# EAGLE design Adafruit 2.4in TFT Breakout (EAGLE 6.4)
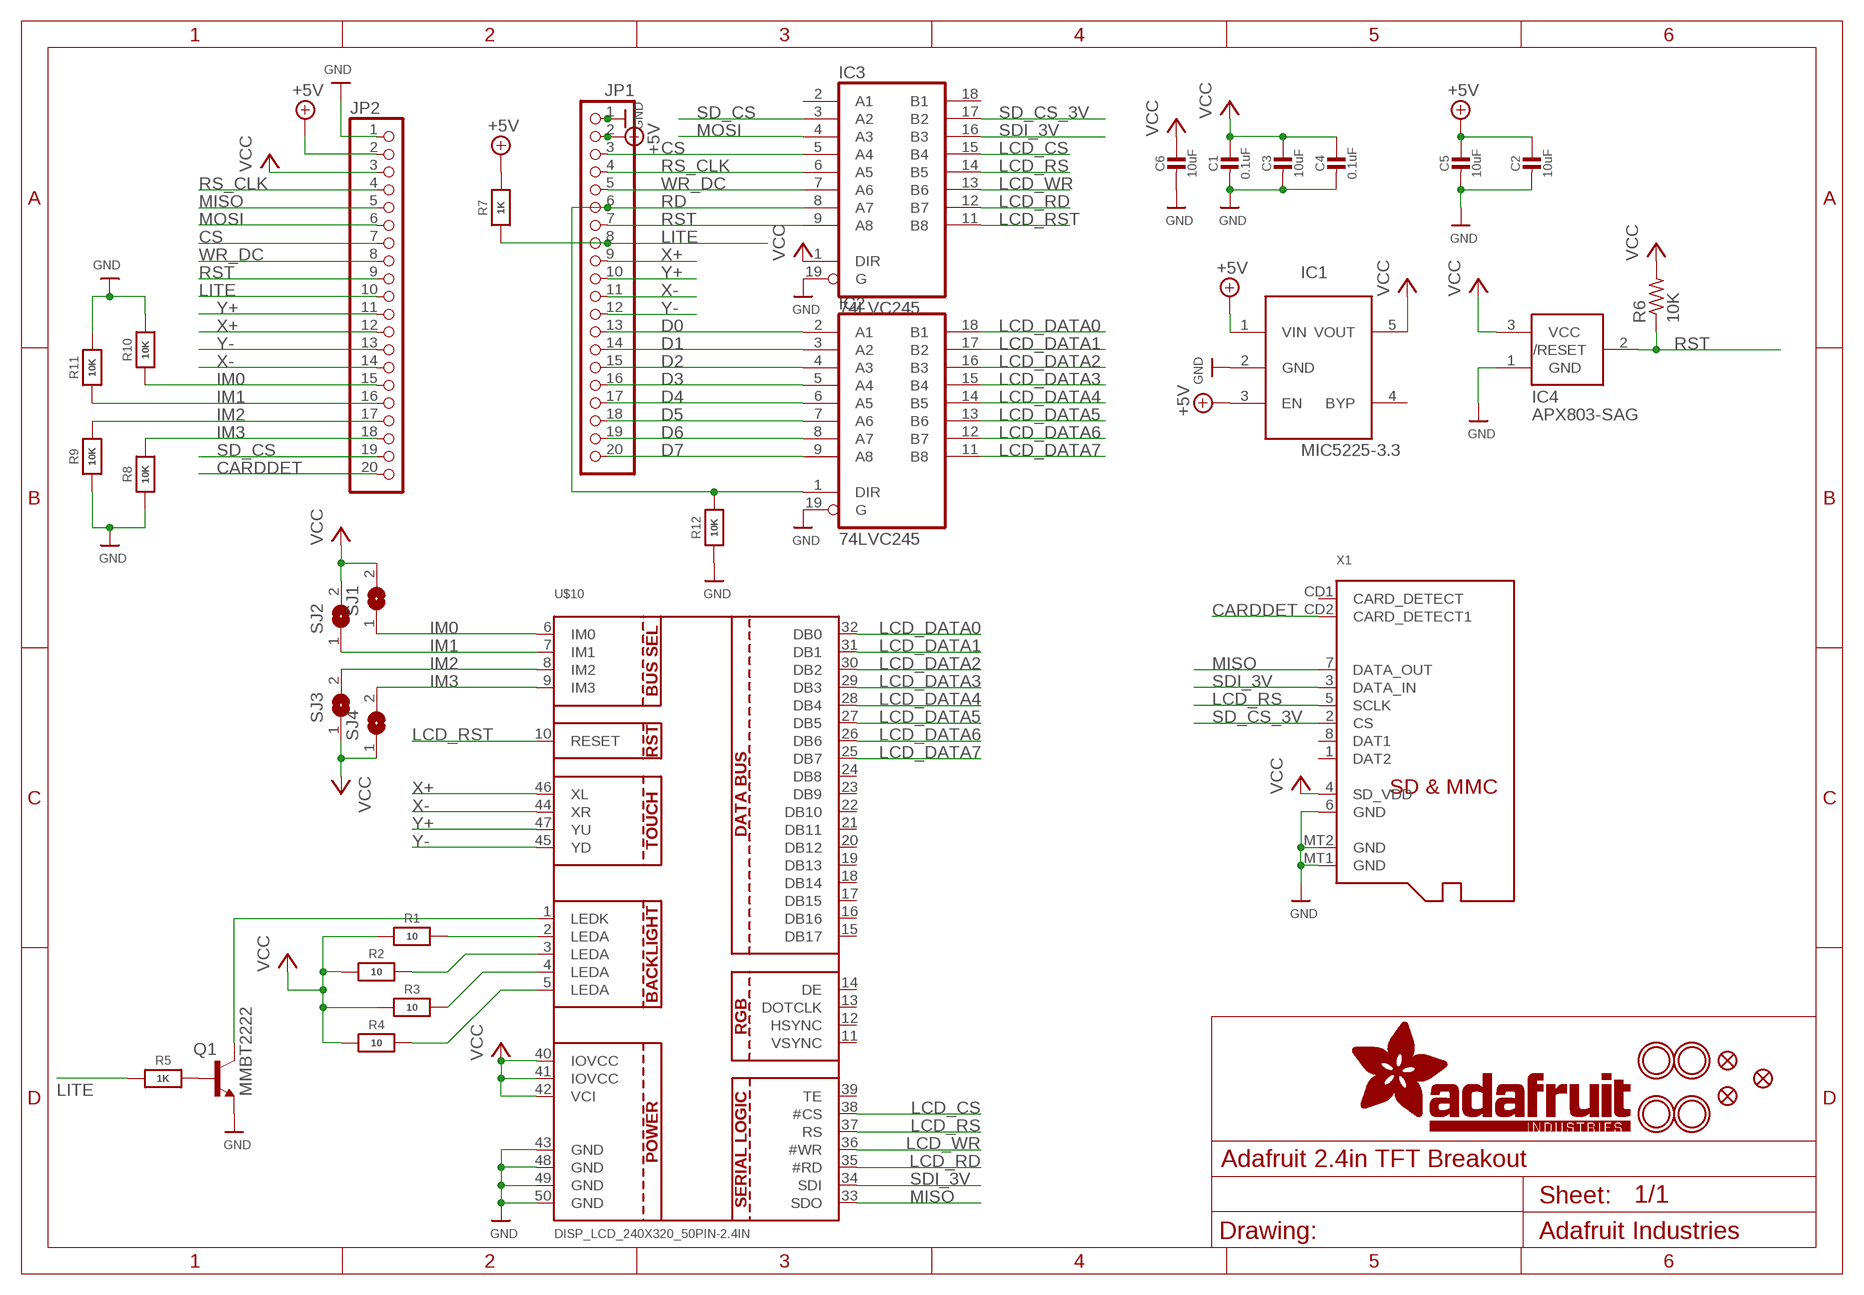
[diagram p0: schematic, sheet 1]

## Parts
C1  0.1uF  CAP_CERAMIC0805-NOOUTLINE  [0805-NO]
C2  10uF  CAP_CERAMIC0805-NOOUTLINE  [0805-NO]
C3  10uF  CAP_CERAMIC0805-NOOUTLINE  [0805-NO]
C4  0.1uF  CAP_CERAMIC0805-NOOUTLINE  [0805-NO]
C5  10uF  CAP_CERAMIC0805-NOOUTLINE  [0805-NO]
C6  10uF  CAP_CERAMIC0805-NOOUTLINE  [0805-NO]
IC1  MIC5225-3.3  LP298XS  [SOT23-5L]
IC2  74LVC245  74ACT245DW  [SO20W]
IC3  74LVC245  74ACT245DW  [SO20W]
IC4  APX803-SAG  AXP083-SAG  [SOT23]
JP1  HEADER-1X20ROUND  [1X20_ROUND]
JP2  HEADER-1X20ROUND  [1X20_ROUND]
Q1  MMBT2222  MMBT2222ALT1-NPN-SOT23-BEC  [SOT23-BEC]
R1  10  RESISTOR0805_NOOUTLINE  [0805-NO]
R2  10  RESISTOR0805_NOOUTLINE  [0805-NO]
R3  10  RESISTOR0805_NOOUTLINE  [0805-NO]
R4  10  RESISTOR0805_NOOUTLINE  [0805-NO]
R5  1K  RESISTOR0805_NOOUTLINE  [0805-NO]
R6  10K  R-US_R0805  [R0805]
R7  1K  RESISTOR0805_NOOUTLINE  [0805-NO]
R8  10K  RESISTOR0805_NOOUTLINE  [0805-NO]
R9  10K  RESISTOR0805_NOOUTLINE  [0805-NO]
R10  10K  RESISTOR0805_NOOUTLINE  [0805-NO]
R11  10K  RESISTOR0805_NOOUTLINE  [0805-NO]
R12  10K  RESISTOR0805_NOOUTLINE  [0805-NO]
SJ1  SOLDERJUMPER  [SOLDERJUMPER_ARROW_NOPASTE]
SJ2  SOLDERJUMPER  [SOLDERJUMPER_ARROW_NOPASTE]
SJ3  SOLDERJUMPER  [SOLDERJUMPER_ARROW_NOPASTE]
SJ4  SOLDERJUMPER  [SOLDERJUMPER_ARROW_NOPASTE]
U$7  MOUNTINGHOLE2.5  [MOUNTINGHOLE_2.5_PLATED]
U$9  FIDUCIAL""  [FIDUCIAL_1MM]
U$10  DISP_LCD_240X320_50PIN-2.4IN  [TFT_2.4IN_240X320_50PIN]
U$11  FIDUCIAL""  [FIDUCIAL_1MM]
U$15  MOUNTINGHOLE2.5  [MOUNTINGHOLE_2.5_PLATED]
U$16  MOUNTINGHOLE2.5  [MOUNTINGHOLE_2.5_PLATED]
U$17  MOUNTINGHOLE2.5  [MOUNTINGHOLE_2.5_PLATED]
U$23  FIDUCIAL""  [FIDUCIAL_1MM]
X1  MICROSD  [MICROSD]

## Nets
+3V: C1.1 C3.1 C4.1 C6.1 IC1.5(VOUT) IC3.1(DIR) IC4.3(VCC) JP2.3 R1.1 R2.1 R3.1 R4.1 R6.2 SJ1.2 SJ2.2 SJ3.1 SJ4.1 U$10.40(IOVCC) U$10.41(IOVCC) U$10.42(VCI) X1.4(SD_VDD) ; supply symbol labelled VCC
CARDDET: JP2.20 X1.CD2(CARD_DETECT1)
CS: IC3.5(A4) JP1.3 JP2.7
D0: IC2.2(A1) JP1.13
D1: IC2.3(A2) JP1.14
D2: IC2.4(A3) JP1.15
D3: IC2.5(A4) JP1.16
D4: IC2.6(A5) JP1.17
D5: IC2.7(A6) JP1.18
D6: IC2.8(A7) JP1.19
D7: IC2.9(A8) JP1.20
GND: C1.2 C2.2 C3.2 C4.2 C5.2 C6.2 IC1.2(GND) IC2.19(G) IC3.19(G) IC4.1(GND) JP1.1 JP2.1 Q1.E R8.1 R9.1 R10.2 R11.2 R12.1 U$10.43(GND) U$10.48(GND) U$10.49(GND) U$10.50(GND) X1.6(GND) X1.MT1(GND) X1.MT2(GND)
IM0: JP2.15 R10.1 SJ1.1 U$10.6(IM0)
IM1: JP2.16 R11.1 SJ2.1 U$10.7(IM1)
IM2: JP2.17 R9.2 SJ3.2 U$10.8(IM2)
IM3: JP2.18 R8.2 SJ4.2 U$10.9(IM3)
LCD_CS: IC3.15(B4) U$10.38(#CS)
LCD_DATA0: IC2.18(B1) U$10.32(DB0)
LCD_DATA1: IC2.17(B2) U$10.31(DB1)
LCD_DATA2: IC2.16(B3) U$10.30(DB2)
LCD_DATA3: IC2.15(B4) U$10.29(DB3)
LCD_DATA4: IC2.14(B5) U$10.28(DB4)
LCD_DATA5: IC2.13(B6) U$10.27(DB5)
LCD_DATA6: IC2.12(B7) U$10.26(DB6)
LCD_DATA7: IC2.11(B8) U$10.25(DB7)
LCD_RD: IC3.12(B7) U$10.35(#RD)
LCD_RS: IC3.14(B5) U$10.37(RS) X1.5(SCLK)
LCD_RST: IC3.11(B8) U$10.10(RESET)
LCD_WR: IC3.13(B6) U$10.36(#WR)
LITE: JP1.8 JP2.10 R5.1 R7.1
MISO: JP2.5 U$10.33(SDO) X1.7(DATA_OUT)
MOSI: IC3.4(A3) JP2.6
N$1: R4.2 U$10.5(LEDA)
N$2: R1.2 U$10.2(LEDA)
N$3: R2.2 U$10.3(LEDA)
N$4: R3.2 U$10.4(LEDA)
N$5: Q1.C U$10.1(LEDK)
N$16: Q1.B R5.2
RD: IC2.1(DIR) IC3.8(A7) JP1.6 R12.2
RS_CLK: IC3.6(A5) JP1.4 JP2.4
RST: IC3.9(A8) IC4.2(/RESET) JP1.7 JP2.9 R6.1
SD_CS: IC3.3(A2) JP2.19
SD_CS_3V: IC3.17(B2) X1.2(CS)
SDI_3V: IC3.16(B3) U$10.34(SDI) X1.3(DATA_IN)
VIN: C2.1 C5.1 IC1.1(VIN) IC1.3(EN) JP1.2 JP2.2 R7.2 ; supply symbol labelled +5V
WR_DC: IC3.7(A6) JP1.5 JP2.8
X+: JP1.9 JP2.12 U$10.46(XL)
X-: JP1.11 JP2.14 U$10.44(XR)
Y+: JP1.10 JP2.11 U$10.47(YU)
Y-: JP1.12 JP2.13 U$10.45(YD)
Unconnected: IC1.4(BYP) IC3.2(A1) IC3.18(B1) U$10.11(VSYNC) U$10.12(HSYNC) U$10.13(DOTCLK) U$10.14(DE) U$10.15(DB17) U$10.16(DB16) U$10.17(DB15) U$10.18(DB14) U$10.19(DB13) U$10.20(DB12) U$10.21(DB11) U$10.22(DB10) U$10.23(DB9) U$10.24(DB8) U$10.39(TE) X1.1(DAT2) X1.8(DAT1) X1.CD1(CARD_DETECT)

## Power pins joined to a net without a drawn wire
+3V: IC2.20(VCC) IC3.20(VCC)
GND: IC2.10(GND) IC3.10(GND)

## Library data of the parts
C1-C6 = microbuilder:CAP_CERAMIC: Ceramic Capacitors For new designs, use the packages preceded by an '_' character since they are more reliable: The following footprints should be used on most boards: _0402 - Standard footprint for regular board layouts _0603 - Standard footprint for regular board layouts _0805 - Standard footprint for regular board layouts _1206 - Standard footprint for regular board layouts For extremely tight-pitch boards where space is at a premium, the following 'micro-pitch' footprints can be used (smaller pads, no silkscreen outline, etc.): _0402MP - Micro-pitch footprint for very dense/compact boards _0603MP - Micro-pitch footprint for very dense/compact boards _0805MP - Micro-pitch footprint for very dense/compact boards _1206MP - Micro-pitch footprint for very dense/compact boards
IC1 = adafruit:LP298X
IC2 IC3 = 74xx-eu:74*245: Octal BUS TRANSCEIVER, 3-state
IC4 = adafruit:AXP083
JP1 JP2 = microbuilder:HEADER-1X20
Q1 = transistor-neu-to92:*-NPN-: NPN Transistror
R1-R5 R7-R12 = microbuilder:RESISTOR: Resistors For new designs, use the packages preceded by an '_' character since they are more reliable: The following footprints should be used on most boards: _0402 - Standard footprint for regular board layouts _0603 - Standard footprint for regular board layouts _0805 - Standard footprint for regular board layouts _1206 - Standard footprint for regular board layouts For extremely tight-pitch boards where space is at a premium, the following 'micro-pitch' footprints can be used (smaller pads, no silkscreen outline, etc.): _0402MP - Micro-pitch footprint for very dense/compact boards _0603MP - Micro-pitch footprint for very dense/compact boards _0805MP - Micro-pitch footprint for very dense/compact boards _1206MP - Micro-pitch footprint for very dense/compact boards
R6 = rcl:R-US_: RESISTOR, American symbol
SJ1-SJ4 = microbuilder:SOLDERJUMPER: SMD Solder JUMPER Solder the two pads together to create a connection, or remove the solder to break it. REFLOW - Use this footprint for solder paste and reflow ovens. WAVE - Use this footprint for hand-soldering (larger pads). CLOSED - Has a trace between the two pads to ensure it is closed by default. The trace needs to be cut to disable the jumper, and can be closed again by creating a solder bridge between the two pads.; BOM: EXCLUDE
U$7 U$15-U$17 = microbuilder:MOUNTINGHOLE: Mounting Hole For #2 screws (0.086"/2.18mm width, 0.094"/2.4mm hole) use 2.5mm; BOM: EXCLUDE
U$9 U$11 U$23 = microbuilder:FIDUCIAL: Fiducial Alignment Points Various fiducial points for machine vision alignment.; BOM: EXCLUDE
U$10 = microbuilder:DISP_LCD_240X320_50PIN
X1 = microbuilder:MICROSD: MicroSD/Transflash Card Holder with SPI pinout 3M: 2908-05WB-MG 4UConnector: 19656 Footprint courtesy: Adafruit Industries

## Board
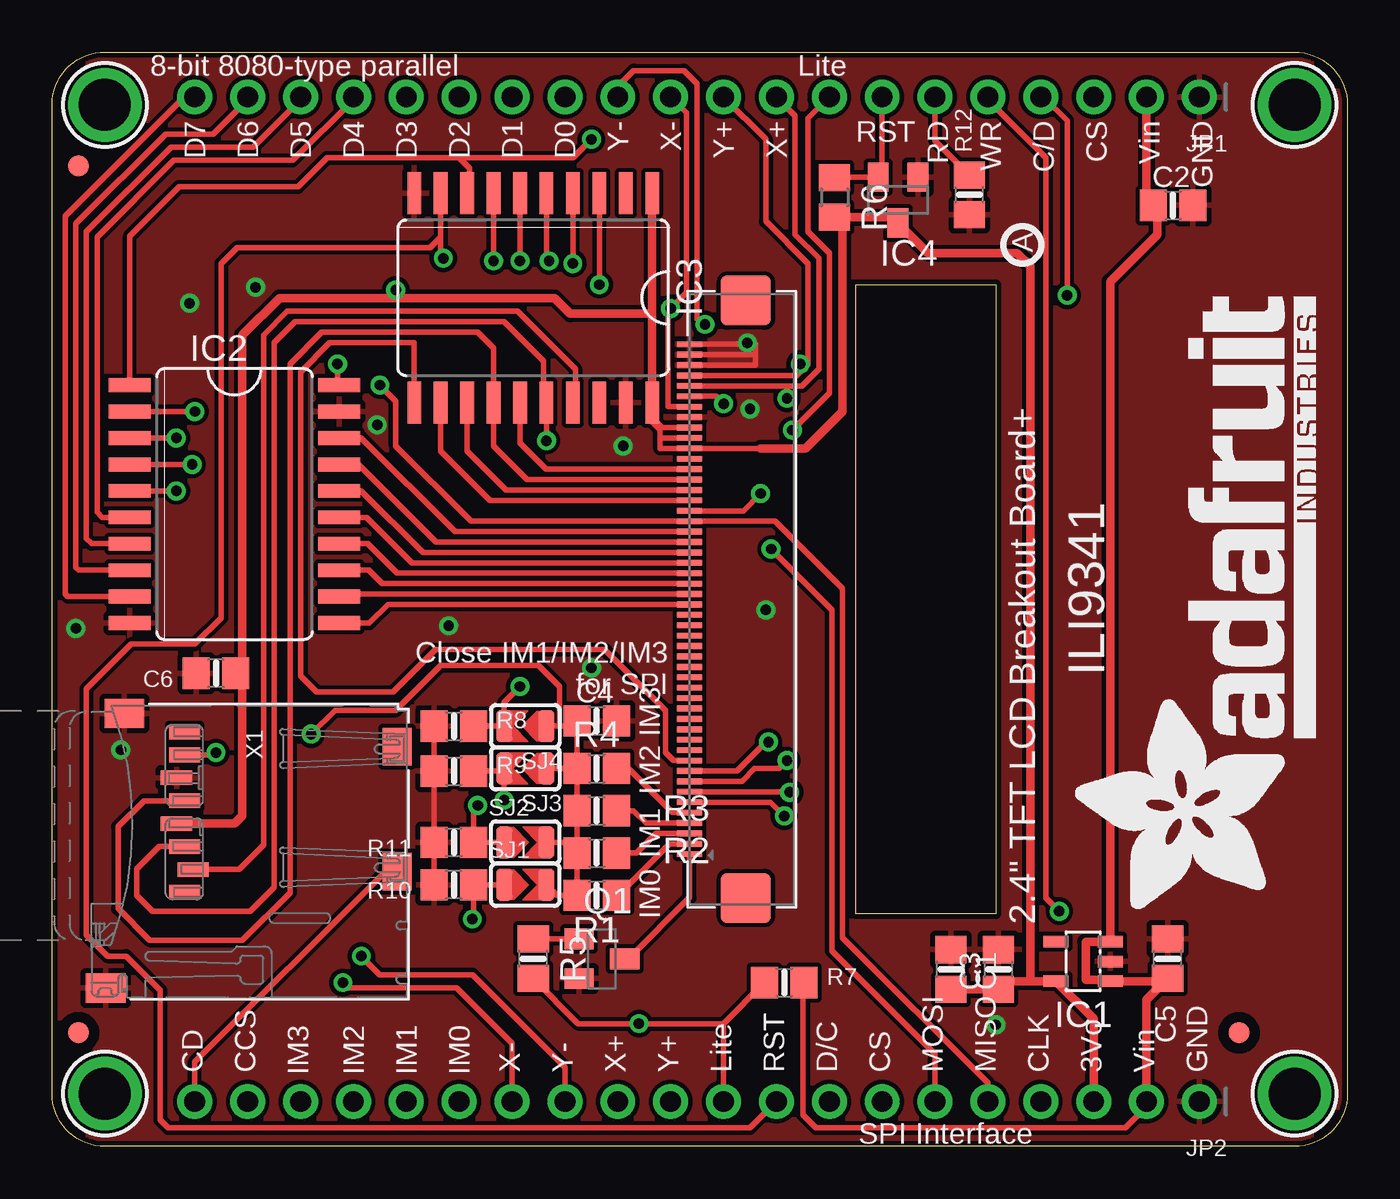
[diagram p1: board, top side]
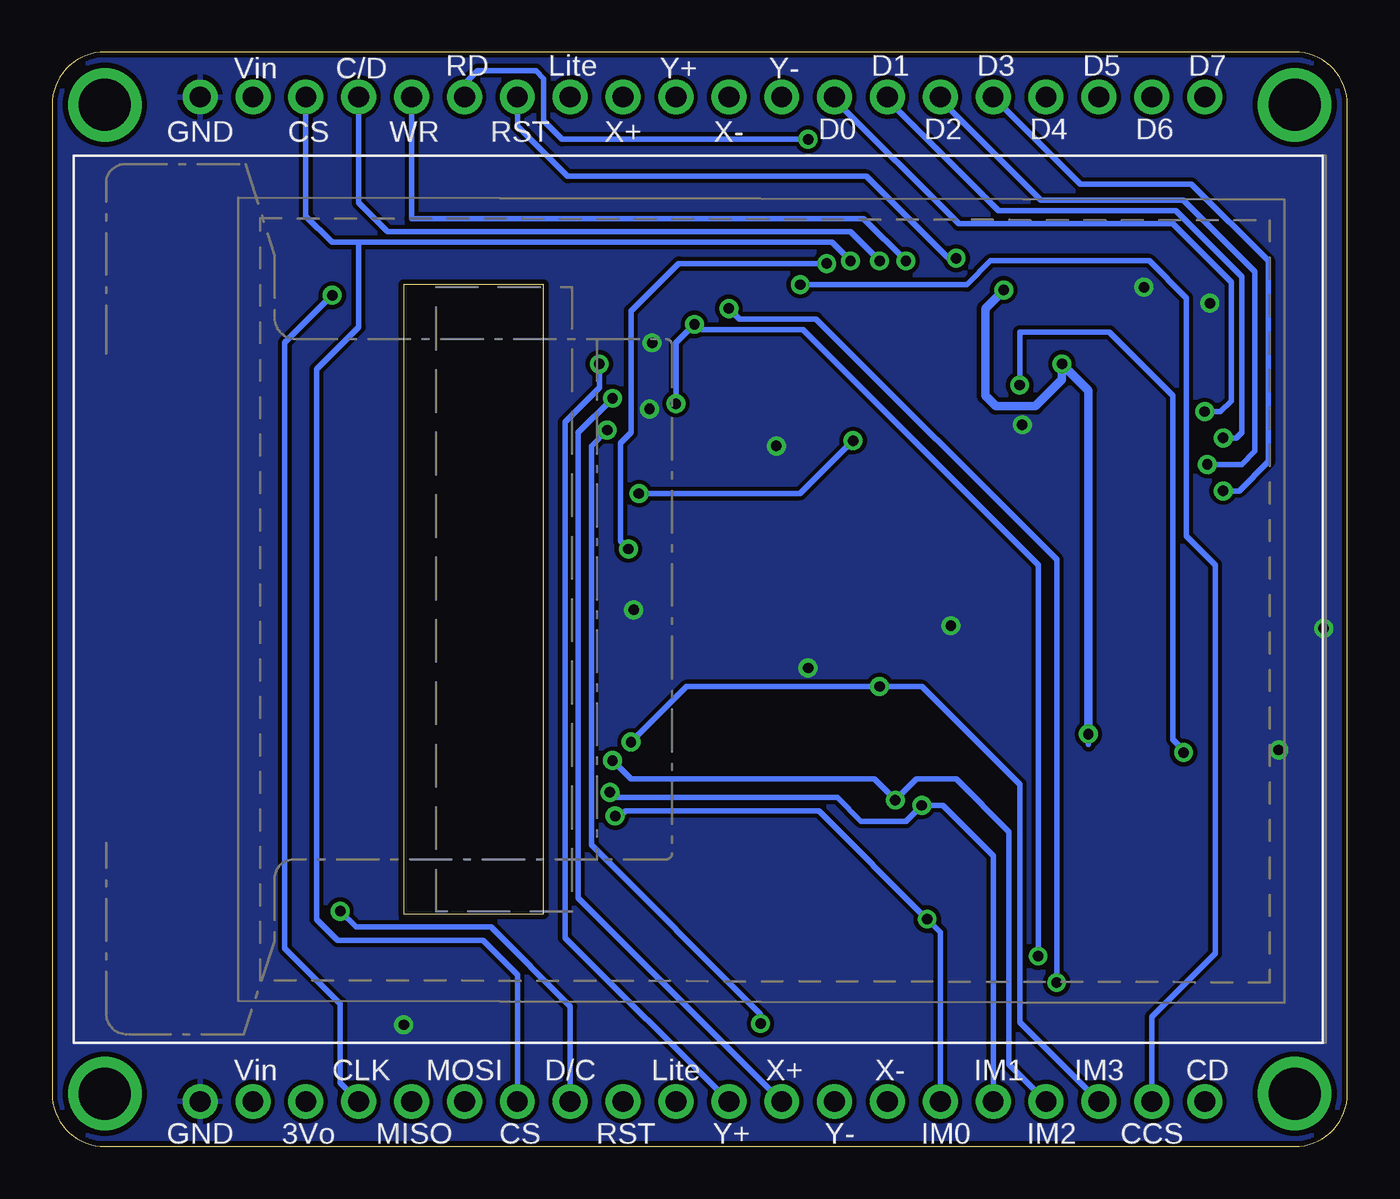
[diagram p2: board, bottom side, seen from below]

Size 62.23 x 52.58 mm. Coordinates in mm from the lower left corner, seen from the top.
Outline: 0,2.54 0,50.04 arc-90 2.54,52.58 59.69,52.58 arc-90 62.23,50.04 62.23,2.54 arc-90 59.69,0 2.54,0 arc-90 0,2.54
Outline: 38.61,11.18 38.61,41.4 45.34,41.4 45.34,11.18 38.61,11.18
Copper layers (1*16): Top 0.035mm / dielectric 1.5mm / Bottom 0.035mm
Design rules "adafruit *": minimum track width 8mil, minimum drill 15.5mil, track to track 8mil, track to pad 8mil, pad to pad 8mil, via to via 8mil, smd to smd 8mil, copper to edge 10mil, drill to drill 8mil, minimum pad ring 10mil, minimum via ring 8mil, stop-mask expansion 2mil, vias tented up to drill 20mil, thermal gap 10mil

### Footprints (pad centres in the part's own frame; a part is rotated, then mirrored left to right if it is on the bottom)
0805-NO = smd 1.3 x 1.5: 1 -0.95,0; 2 0.95,0
SOT23-5L = smd 0.55 x 1.2: 1 -0.95,-1.3; 2 0,-1.3; 3 0.95,-1.3; 4 0.95,1.3; 5 -0.95,1.3
SO20W = smd 0.66 x 2.032: 1 -5.715,-5.029; 2 -4.445,-5.029; 3 -3.175,-5.029; 4 -1.905,-5.029; 5 -0.635,-5.029; 6 0.635,-5.029; 7 1.905,-5.029; 8 3.175,-5.029; 9 4.445,-5.029; 10 5.715,-5.029; 11 5.715,5.029; 12 4.445,5.029; 13 3.175,5.029; 14 1.905,5.029; 15 0.635,5.029; 16 -0.635,5.029; 17 -1.905,5.029; 18 -3.175,5.029; 19 -4.445,5.029; 20 -5.715,5.029
SOT23 = smd 1 x 1.4: 1 -0.95,-1.1; 2 0.95,-1.1; 3 0,1.1
1X20_ROUND = drill 1 pad 1.676: 1 -24.13,0; 2 -21.59,0; 3 -19.05,0; 4 -16.51,0; 5 -13.97,0; 6 -11.43,0; 7 -8.89,0; 8 -6.35,0; 9 -3.81,0; 10 -1.27,0; 11 1.27,0; 12 3.81,0; 13 6.35,0; 14 8.89,0; 15 11.43,0; 16 13.97,0; 17 16.51,0; 18 19.05,0; 19 21.59,0; 20 24.13,0
SOT23-BEC = smd 1 x 1.4: B -0.95,-1.1; C 0,1.1; E 0.95,-1.1
R0805 = smd 1.3 x 1.5: 1 -0.95,0; 2 0.95,0
SOLDERJUMPER_ARROW_NOPASTE = smd 0.762 x 1.524: 1 -1.016,0; 2 1.016,0
MOUNTINGHOLE_2.5_PLATED = drill 2.5 pad 3.2: P$1 0,0
FIDUCIAL_1MM = smd 1 x 1: 1 0,0
TFT_2.4IN_240X320_50PIN = smd 0.275 x 1.2 bottom: 1 12.25,28.551; 2 11.75,28.551; 3 11.25,28.551; 4 10.75,28.551; 5 10.25,28.551; 6 9.75,28.551; 7 9.25,28.551; 8 8.75,28.551; 9 8.25,28.551; 10 7.75,28.551; 11 7.25,28.551; 12 6.75,28.551; 13 6.25,28.551; 14 5.75,28.551; 15 5.25,28.551; 16 4.75,28.551; 17 4.25,28.551; 18 3.75,28.551; 19 3.25,28.551; 20 2.75,28.551; 21 2.25,28.551; 22 1.75,28.551; 23 1.25,28.551; 24 0.75,28.551; 25 0.25,28.551; 26 -0.25,28.551; 27 -0.75,28.551; 28 -1.25,28.551; 29 -1.75,28.551; 30 -2.25,28.551; 31 -2.75,28.551; 32 -3.25,28.551; 33 -3.75,28.551; 34 -4.25,28.551; 35 -4.75,28.551; 36 -5.25,28.551; 37 -5.75,28.551; 38 -6.25,28.551; 39 -6.75,28.551; 40 -7.25,28.551; 41 -7.75,28.551; 42 -8.25,28.551; 43 -8.75,28.551; 44 -9.25,28.551; 45 -9.75,28.551; 46 -10.25,28.551; 47 -10.75,28.551; 48 -11.25,28.551; 49 -11.75,28.551; 50 -12.25,28.551 | smd 2.4 x 2.4 bottom: PAD1 14.35,25.851; PAD2 -14.35,25.851
MICROSD = smd 0.7 x 1.5: 1 9,-10.64; 2 7.9,-10.24; 3 6.8,-10.64; 4 5.7,-11.04; 5 4.6,-10.64; 6 3.5,-11.04; 7 2.4,-10.64; 8 1.3,-10.64 | smd 1.8 x 1.4: CD1 2,-0.44; CD2 8,-0.44 | smd 1.4 x 1.9: MT1 0.4,-13.54; MT2 13.6,-14.44

### Placement (x,y rotation side)
C1  43.18,8.51 90 top
C2  53.85,45.21 0 top
C3  45.47,8.51 90 top
C4  26.16,20.45 0 top
C5  53.59,9.02 90 top
C6  7.87,22.73 180 top
IC1  49.53,8.89 90 top
IC2  8.76,30.86 270 top
IC3  23.11,40.77 180 top
IC4  40.64,45.47 180 top
JP1  30.99,50.42 180 top
JP2  30.99,2.16 180 top
Q1  26.42,9.02 270 top
R1  26.16,12.06 0 top
R2  26.16,14.1 0 top
R3  26.16,16.13 0 top
R4  26.16,18.16 0 top
R5  23.11,9.02 90 top
R6  37.59,45.59 270 top
R7  35.18,7.87 0 top
R8  19.3,20.19 0 top
R9  19.3,18.03 0 top
R10  19.3,12.57 180 top
R11  19.3,14.61 180 top
R12  44.07,45.72 90 top
SJ1  22.73,12.57 0 top
SJ2  22.73,14.61 0 top
SJ3  22.73,18.16 180 top
SJ4  22.73,20.19 180 top
U$7  2.54,2.54 0 top
U$9  57.02,5.46 0 top
U$10  59.18,26.29 270 bottom
U$11  1.27,47.12 0 top
U$15  59.69,2.54 0 top
U$16  2.54,50.04 0 top
U$17  59.69,50.04 0 top
U$19  [ADAFRUIT_TEXT_30MM]  60.71,11.18 90 top
U$23  1.27,5.46 0 top
U$26  [PCBFEAT-REV-040]  46.61,43.31 90 top
X1  17.02,21.21 270 top

### Tracks (layer width: path | path; a pad name or v marks a point on that pad's centre or on a via)
+3V  (via drill 0.5)
  Top 0.254: U$10.42 29.21,34.54 29.21,34.04 | 28.83,34.92 IC3.20 | 34.04,33.54 U$10.40 29.21,33.54 29.21,34.04 | 40.36,44.64 IC4.3 | R2.1 R3.1 R4.1 | R2.1 R1.1 24.26,12.06 SJ1.2 | R4.1 C4.1 24.96,20.19 24.38,20.19 | SJ4.1 24.38,20.19 | SJ3.1 R4.1 | SJ2.2 24.7,14.61 R2.1 | IC2.20 13.72,36.65 v13.72,37.59 | v12.45,19.81 13.59,20.95 16.51,20.95 18.67,23.11 23.37,23.11 24.38,22.1 24.38,20.19 | v16.51,41.15 16.51,40.77 | C6.1 9.02,22.73 9.14,22.86 | U$10.41 29.21,34.04 | 37.97,44.52 37.85,44.64 R6.2
  Top 0.406: IC3.1 28.83,40.01 | 28.83,40.01 IC3.20 | 29.21,34.54 28.83,34.92 | R6.2 40.36,44.64 | JP2.3 50.04,6.13 IC1.5 46.99,7.94 | C1.1 C3.1 45.85,7.94 46.99,7.94 | X1.4 8.76,15.51 9.14,15.89 9.14,22.86 9.14,38.99 10.92,40.77 16.51,40.77 24.13,40.77 24.89,40.01 28.83,40.01 | 37.97,44.52 37.97,35.32 36.2,33.54 34.04,33.54 | IC4.3 42.08,42.93 46.35,42.93 46.99,42.29 46.99,7.94
  Bottom 0.254: 12.45,19.3 v12.45,19.81
  Bottom 0.406: v12.45,19.81 12.45,36.32 v13.72,37.59 13.72,36.83 14.99,35.56 16.89,35.56 17.4,36.07 17.4,40.26 v16.51,41.15
CARDDET
  Top 0.254: JP2.20 6.86,4.06 15.88,13.08 16.45,13.08 X1.CD2
CS  (via drill 0.5)
  Top 0.254: v23.88,42.55 23.75,42.67 IC3.5
  Bottom 0.254: JP1.3 50.04,44.7 48.77,43.43 47.5,43.43 | 47.5,43.43 24.77,43.43 v23.88,42.55 | JP2.7 39.88,8.26 41.53,9.91 48.51,9.91 49.53,10.92 49.53,37.34 47.5,39.37 47.5,43.43
D0  (via drill 0.5)
  Top 0.254: v6.86,35.31 IC2.2
  Bottom 0.254: v6.86,35.31 6.1,35.31 5.59,35.81 5.59,41.53 8.38,44.32 18.67,44.32 24.64,50.29 JP1.13
D1  (via drill 0.5)
  Top 0.254: v5.97,34.04 IC2.3
  Bottom 0.254: v5.97,34.04 5.33,34.04 5.08,34.29 5.08,41.78 8.26,44.96 16.76,44.96 22.1,50.29 JP1.14
D2  (via drill 0.5)
  Top 0.254: v6.73,32.77 IC2.4
  Bottom 0.254: v6.73,32.77 5.08,32.77 4.45,33.4 4.45,42.04 7.87,45.47 14.73,45.47 19.56,50.29 JP1.15
D3  (via drill 0.5)
  Top 0.254: v5.97,31.5 IC2.5
  Bottom 0.254: JP1.16 12.83,46.23 7.49,46.23 3.81,42.55 3.81,32.89 5.21,31.5 v5.97,31.5
D4
  Top 0.254: IC2.6 2.41,30.23 2.16,30.48 2.16,43.69 5.84,47.37 11.56,47.37 14.48,50.29 JP1.17
D5
  Top 0.254: IC2.7 1.91,28.96 1.65,29.21 1.65,43.94 5.71,48.01 9.65,48.01 11.94,50.29 JP1.18
D6
  Top 0.254: IC2.8 1.27,27.69 1.14,27.81 1.14,44.32 5.46,48.64 7.75,48.64 9.4,50.29 JP1.19
D7
  Top 0.254: IC2.9 0.76,26.42 0.64,26.54 0.64,44.7 6.35,50.42 JP1.20
GND  (via drill 0.5)
  Top 0.254: U$10.50 33.78,38.54 33.78,38.04 | 33.78,38.04 33.78,37.54 U$10.48 | U$10.49 33.78,38.04 | R8.1 R9.1 R11.2 R10.2
  other vias: 27.43,33.66 33.53,35.43 33.4,38.61 15.62,34.67 45.34,5.84 3.3,19.05 1.14,24.89 19.05,25.02 34.29,25.78 9.78,41.27 6.6,40.51 25.91,22.99
  pour Bottom: -0.51,53.34 -0.51,-0.64 62.61,-0.64 62.61,53.34
  pour Top: -0.51,53.47 -0.51,-0.51 62.61,-0.51 62.61,53.47
IM0  (via drill 0.5)
  Top 0.254: v35.18,15.88 34.52,16.54 U$10.6 | SJ1.1 R10.1 20.25,10.98 v20.19,10.92
  Bottom 0.254: v35.18,15.88 34.92,15.88 34.67,16.13 25.4,16.13 v20.19,10.92 19.56,10.29 JP2.15
IM1  (via drill 0.5)
  Top 0.254: U$10.7 35.41,17.04 v35.43,17.02 | SJ2.1 R11.1 20.25,16.19 v20.45,16.38 20.38,16.32
  Bottom 0.254: 35.31,16.89 v35.43,17.02 35.18,16.76 24.51,16.76 23.37,15.62 21.21,15.62 v20.45,16.38 19.43,16.38 17.02,13.97 JP2.16
IM2  (via drill 0.5)
  Top 0.254: v21.72,16.64 SJ3.2 21.59,18.03 R9.2 | v35.31,18.54 34.92,18.16 33.76,18.16 33.13,17.54 U$10.8
  Bottom 0.254: JP2.17 16.26,3.94 16.26,15.11 18.8,17.65 20.7,17.65 v21.72,16.64 22.73,17.65 34.42,17.65 v35.31,18.54
IM3  (via drill 0.5)
  Top 0.254: v22.48,22.1 21.72,21.34 SJ4.2 R8.2 | v34.42,19.43 34.29,19.43 32.89,18.03 U$10.9
  Bottom 0.254: v34.42,19.43 31.75,22.1 v22.48,22.1 20.45,22.1 15.75,17.4 15.75,5.97 JP2.18
LCD_CS
  Top 0.254: U$10.38 23.72,32.54 22.48,33.78 IC3.15
LCD_DATA0
  Top 0.254: U$10.32 19.36,29.54 14.86,34.04 IC2.18
LCD_DATA1
  Top 0.254: U$10.31 18.46,29.04 14.73,32.77 IC2.17
LCD_DATA2
  Top 0.254: U$10.30 17.82,28.54 14.86,31.5 IC2.16
LCD_DATA3
  Top 0.254: U$10.29 17.3,28.04 15.11,30.23 IC2.15
LCD_DATA4
  Top 0.254: U$10.28 16.57,27.54 15.15,28.96 IC2.14
LCD_DATA5
  Top 0.254: U$10.27 15.86,27.04 15.24,27.66 15.24,27.69 IC2.13
LCD_DATA6
  Top 0.254: U$10.26 13.91,26.54 IC2.12
LCD_DATA7
  Top 0.254: U$10.25 16.13,26.04 15.24,25.15 IC2.11
LCD_RD
  Top 0.254: U$10.35 21.03,31.04 18.67,33.4 IC3.12
LCD_RS
  Top 0.254: U$10.37 22.82,32.04 21.21,33.66 IC3.14 21.21,38.35 20.45,39.12 12.95,39.12 11.43,37.59 11.43,12.19 9.14,9.91 4.7,9.91 3.17,11.43 3.17,15.37 4.42,16.61 X1.5
LCD_RST
  Top 0.254: IC3.11 17.4,38.61 13.34,38.61 11.94,37.21 11.94,22.61 12.7,21.84 16.38,21.84 18.41,23.88 26.54,23.88 29.46,20.95 29.46,18.92 29.84,18.54 U$10.10
LCD_WR
  Top 0.254: U$10.36 21.8,31.54 19.94,33.4 IC3.13
LITE  (via drill 0.5)
  Top 0.254: R7.1 32.26,5.9 | 32.26,5.9 JP2.10 | R5.1 25.28,5.9 v28.19,5.9 32.26,5.9 | v35.56,34.42 37.34,36.2 37.34,42.93 36.32,43.94 36.32,49.4 JP1.8
  Bottom 0.254: v35.56,34.42 36.32,33.66 36.32,14.48 28.19,6.35 v28.19,5.9
MISO  (via drill 0.5)
  Top 0.254: v15.75,36.58 16.51,35.81 16.51,33.66 20.13,30.04 U$10.33 34.73,30.04 37.97,26.8 37.97,10.03 44.96,3.05 JP2.5 | v7.87,18.92 7.76,18.81 X1.7
  Bottom 0.254: v15.75,36.58 15.75,39.12 11.43,39.12 8.38,36.07 8.38,19.56 7.87,19.05 v7.87,18.92
MOSI  (via drill 0.5)
  Top 0.254: JP2.6 42.42,4.45 37.47,9.4 37.47,25.78 v34.54,28.7 | v25.02,42.42 IC3.4
  Bottom 0.254: v34.54,28.7 34.92,29.08 34.92,33.78 34.42,34.29 34.42,40.13 32.13,42.42 v25.02,42.42
N$1
  Top 0.254: U$10.5 29.81,16.04 27.69,18.16 R4.2
N$2
  Top 0.254: U$10.2 29.65,14.54 27.18,12.06 R1.2
N$3
  Top 0.254: U$10.3 29.01,15.04 28.07,14.1 R2.2
N$4
  Top 0.254: U$10.4 28.53,15.54 27.94,16.13 R3.2
N$5
  Top 0.254: 27.52,9.15 Q1.C 27.69,9.02 30.63,11.96 U$10.1
N$16
  Top 0.254: Q1.B R5.2
RD  (via drill 0.5)
  Top 0.254: IC2.1 3.73,43.74 6.1,46.1 11.81,46.1 13.21,47.5 19.56,47.5 | 19.56,47.5 20.07,46.99 20.07,45.92 IC3.8 | JP1.6 42.42,48.32 R12.2 | 19.56,47.5 25.02,47.5 v25.91,48.39
  Bottom 0.254: v25.91,48.39 37.72,48.39 38.61,49.28 38.61,51.31 38.99,51.69 41.78,51.69 42.42,51.05 JP1.6
RS_CLK  (via drill 0.5)
  Top 0.254: v22.48,42.55 IC3.6 | v48.77,40.89 48.77,49.28 47.62,50.42 JP1.4
  Bottom 0.254: JP1.4 47.5,45.34 46.1,43.94 23.88,43.94 v22.48,42.55 | JP2.4 48.39,3.05 48.39,6.86 51.05,9.53 51.05,38.61 v48.77,40.89
RST  (via drill 0.5)
  Top 0.254: JP1.7 39.88,46.75 IC4.2 37.62,46.57 R6.1 | IC3.9 18.67,43.69 | 18.67,43.69 18.67,42.8 v18.8,42.67 | 18.67,43.69 18.16,43.18 8.89,43.18 8.13,42.42 8.13,25.4 6.86,24.13 3.81,24.13 1.65,21.97 1.65,10.16 2.67,9.14 3.56,9.14 5.21,7.49 5.21,1.27 5.59,0.89 33.53,0.89 JP2.9
  Bottom 0.254: v18.8,42.67 19.18,42.67 23.11,46.61 37.47,46.61 39.88,49.02 JP1.7
SD_CS  (via drill 0.5)
  Top 0.254: v26.29,41.4 IC3.3
  Bottom 0.254: JP2.19 9.4,6.22 6.35,9.27 6.35,27.94 7.75,29.34 7.75,40.77 9.53,42.55 17.14,42.55 18.29,41.4 v26.29,41.4
SD_CS_3V
  Top 0.254: IC3.17 25.15,35.87 25.15,37.34 22.35,40.13 11.3,40.13 10.16,38.99 10.16,14.48 8.99,13.31 X1.2
SDI_3V  (via drill 0.5)
  Top 0.254: X1.3 5.14,14.41 4.06,13.34 4.06,12.06 4.83,11.3 9.53,11.3 10.67,12.45 10.67,38.61 11.68,39.62 21.72,39.62 23.62,37.72 23.62,35.87 IC3.16 v23.75,33.91 | U$10.34 33.21,30.54 v34.04,31.37
  Bottom 0.254: v34.04,31.37 26.29,31.37 v23.75,33.91
VIN
  Top 0.254: 52.58,45.53 C2.1 | R7.2 36.07,7.81 36.07,1.52 36.7,0.89 51.56,0.89 52.58,1.91 JP2.2
  Top 0.406: JP1.2 52.58,45.53 | C2.1 53.09,45.02 53.09,43.81 50.83,41.56 IC1.3 49.66,9.84 49.66,8 50.83,8 IC1.1 53.47,7.94 C5.1 52.58,7.05 JP2.2
WR_DC  (via drill 0.5)
  Top 0.254: v21.21,42.55 IC3.7 | v48.39,11.3 47.75,11.94 47.75,47.5 44.96,50.29 JP1.5
  Bottom 0.254: JP1.5 44.96,44.58 23.24,44.58 v21.21,42.55 | JP2.8 37.34,6.73 41.15,10.54 47.62,10.54 v48.39,11.3
X+  (via drill 0.5)
  Top 0.254: 35.31,36.54 36.03,36.54 36.83,37.34 36.83,42.67 35.69,43.81 35.69,49.53 JP1.9 | 35.31,36.54 U$10.46 | v35.31,35.94 35.31,36.54
  Bottom 0.254: JP2.12 36.96,11.94 36.96,34.29 v35.31,35.94
X-  (via drill 0.5)
  Top 0.254: JP2.14 22.1,4.95 19.43,7.62 14.22,7.62 v13.97,7.87 | U$10.44 29.61,35.54 29.59,35.56 29.59,40.13 v29.72,40.26 30.48,41.02 30.48,49.66 JP1.11
  Bottom 0.254: v29.72,40.26 29.21,39.75 25.53,39.75 13.97,28.19 v13.97,7.87
Y+  (via drill 0.5)
  Top 0.254: 35.94,37.21 35.77,37.04 U$10.47 | v35.94,37.59 35.94,37.21 | 35.94,37.21 36.32,37.59 36.32,42.42 34.29,44.45 34.29,48.39 JP1.10
  Bottom 0.254: JP2.11 37.59,10.03 37.59,34.8 35.94,36.45 v35.94,37.59
Y-  (via drill 0.5)
  Top 0.254: JP1.12 27.18,50.93 27.94,51.69 30.35,51.69 30.99,51.05 30.99,39.75 31.11,39.75 v31.37,39.5 | JP2.13 24.64,3.81 20.19,8.26 15.75,8.26 v14.86,9.14 | U$10.45 31.91,36.04 v32.26,35.69
  Bottom 0.254: v14.86,9.14 14.86,27.94 26.16,39.24 30.99,39.24 31.24,39.5 v31.37,39.5 32.26,38.61 v32.26,35.69

### Text on the board
tPlace: 8-bit 8080-type parallel | Lite | D7 | D6 | D5 | D4 | D3 | D2 | D1 | D0 | Y- | X- | Y+ | X+ | RD | WR | C/D | CS | Vin | GND | RST | Close IM1/IM2/IM3 / for SPI | ILI9341 | IM3 | IM2 | IM1 | IM0 | 2.4" TFT LCD Breakout Board+ | CD | CCS | X- | Y- | X+ | Y+ | Lite | RST | D/C | CS | MOSI | MISO | CLK | 3Vo | Vin | GND | IM3 | IM2 | IM1 | IM0 | SPI Interface
bPlace: Y- | Y+ | Lite | RD | C/D | Vin | D7 | D5 | D3 | D1 | D6 | D4 | D2 | D0 | X- | X+ | RST | WR | CS | GND | CD | IM3 | IM1 | X- | X+ | Lite | D/C | MOSI | CLK | Vin | CCS | IM2 | IM0 | Y- | Y+ | RST | CS | MISO | 3Vo | GND